# EAGLE schematic BBB_v1 (EAGLE 5.11)
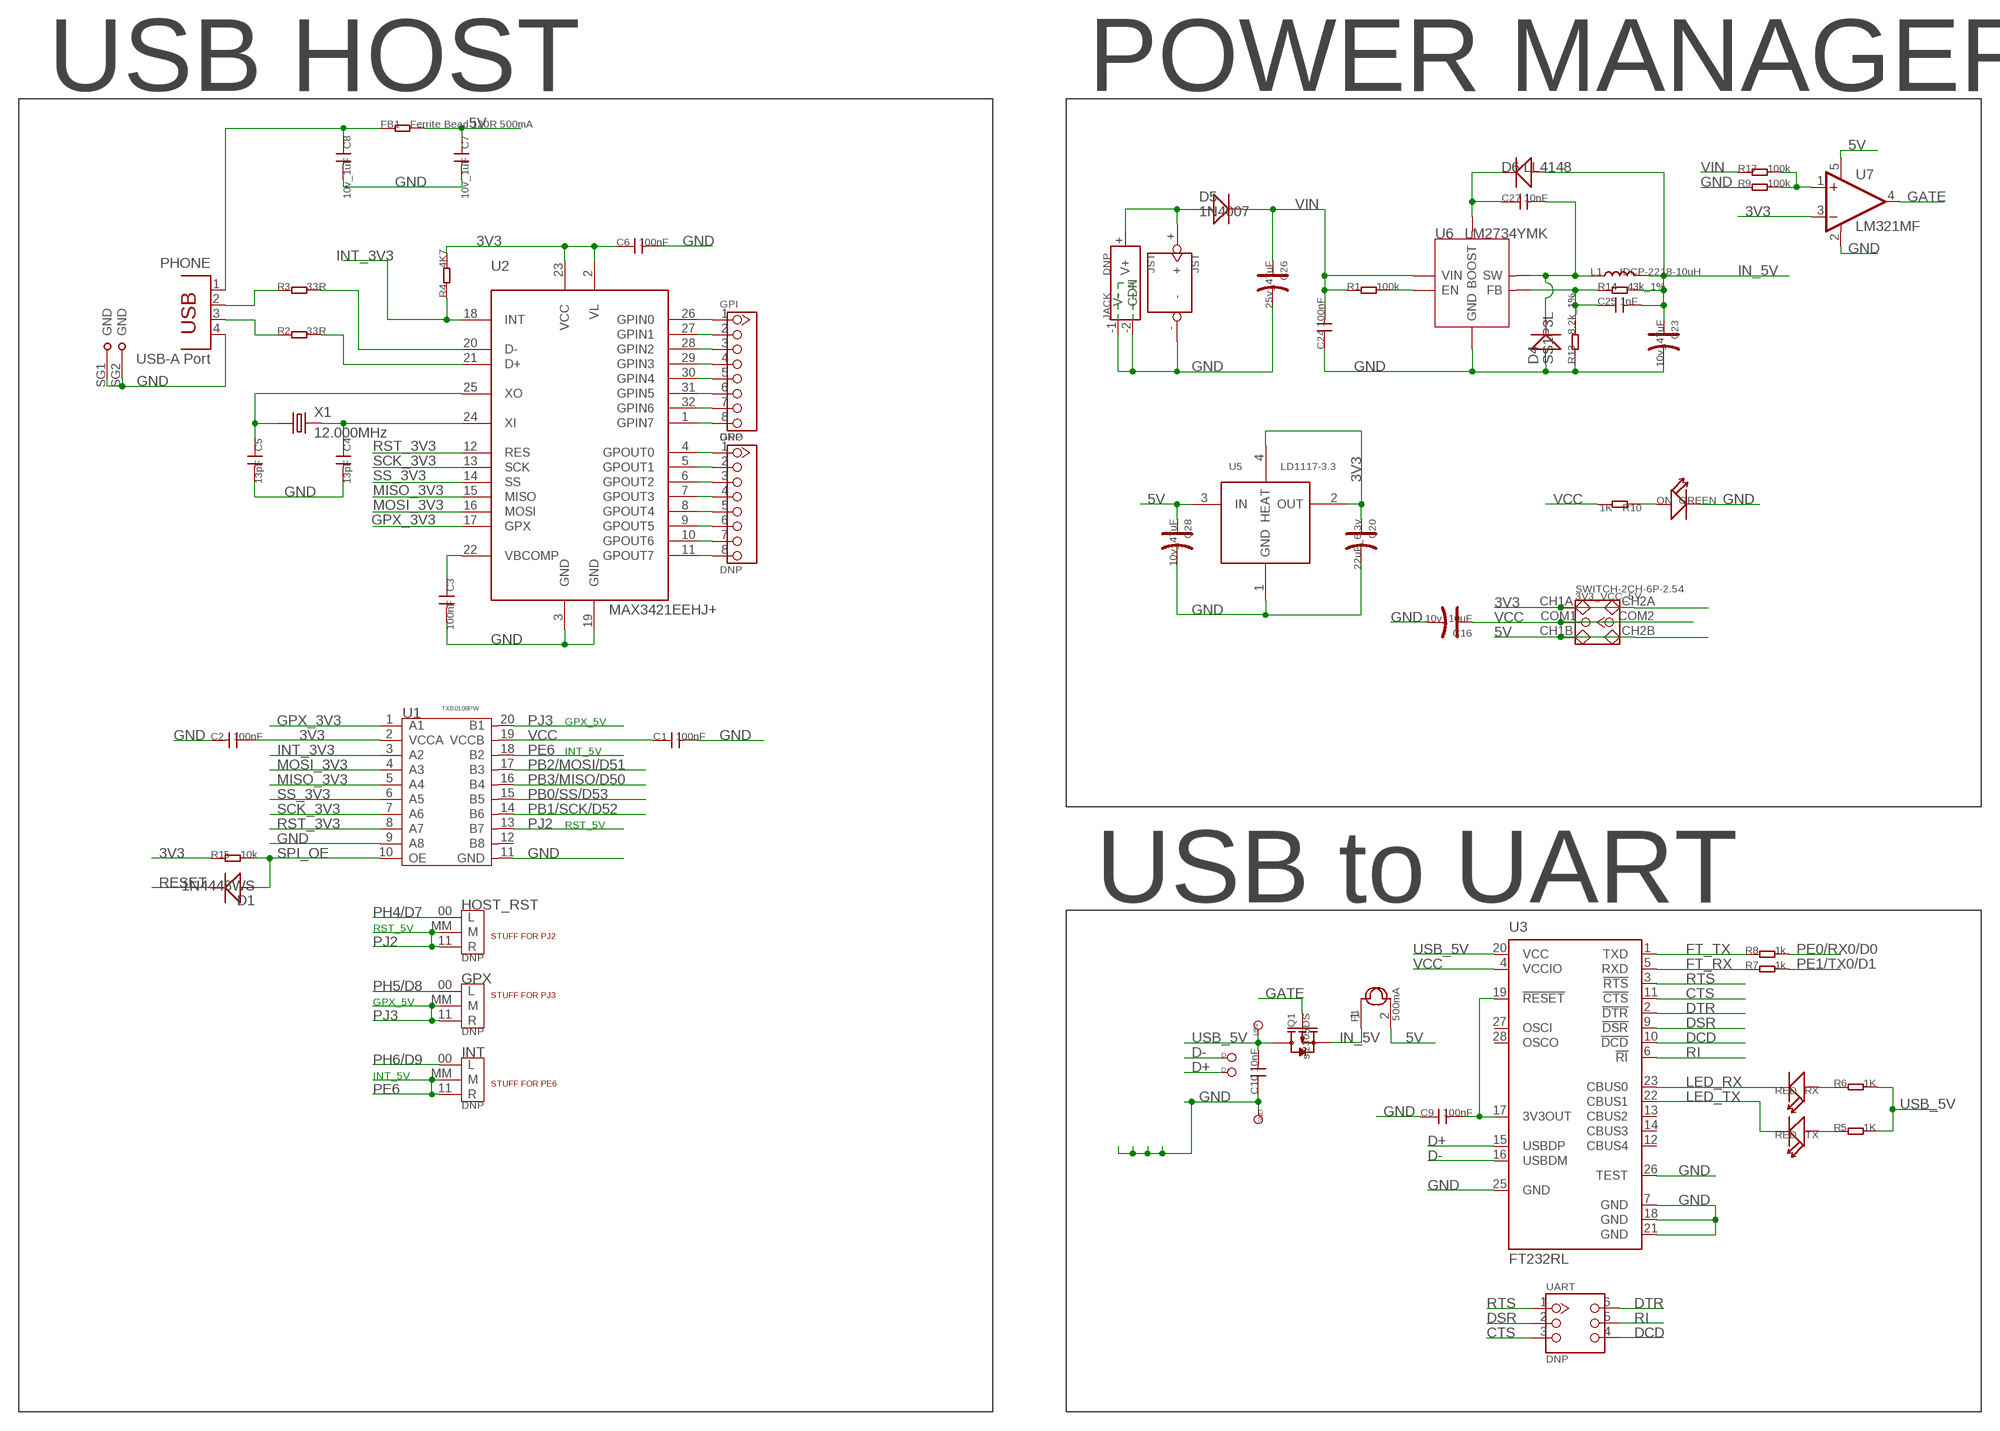
[diagram p0: schematic, sheet 1, part 1 of 2]
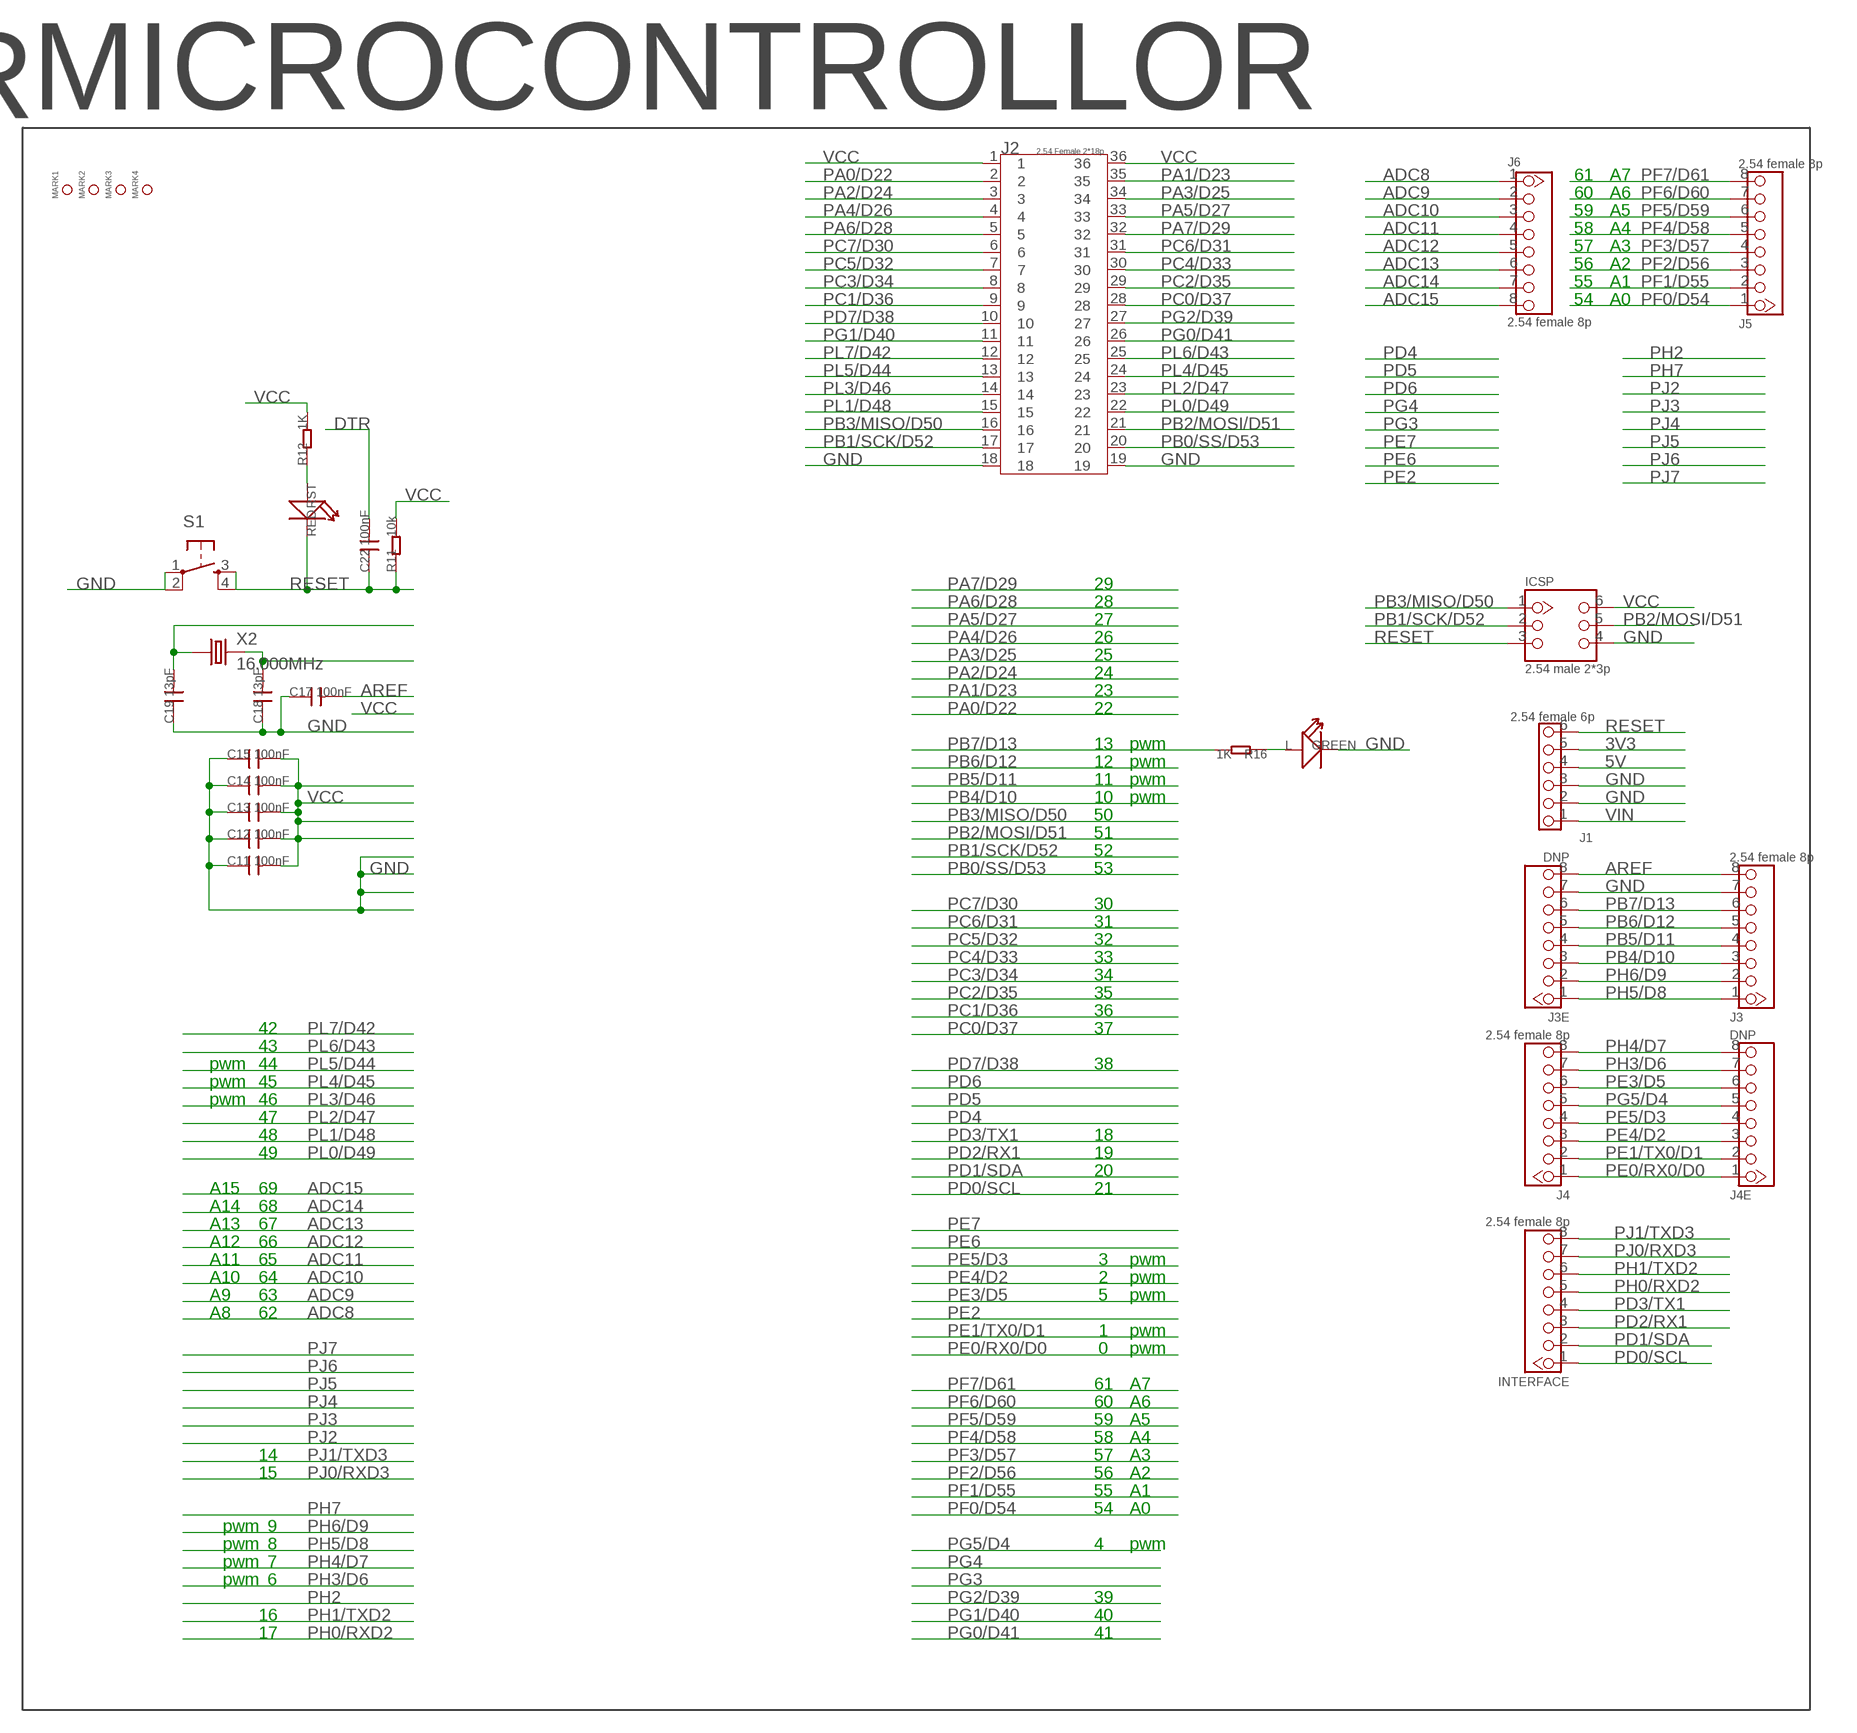
[diagram p1: schematic, sheet 1, part 2 of 2]

## Parts
3V3_VCC_5V  SWITCH-2CH-6P-2.54  [2.54SW-2CH]
C1  100nF  C-0402  [0402]
C2  100nF  C-0402  [0402]
C3  100nF  C-0402  [0402]
C4  13pF  C-0402  [0402]
C5  13pF  C-0402  [0402]
C6  100nF  C-0402  [0402]
C7  10v_1uF  C-0603  [0603]
C8  10v_1uF  C-0603  [0603]
C9  100nF  C-0402  [0402]
C10  10nF  C-0402  [0402]
C11  100nF  C-0402  [0402]
C12  100nF  C-0402  [0402]
C13  100nF  C-0402  [0402]
C14  100nF  C-0402  [0402]
C15  100nF  C-0402  [0402]
C16  10v_10uF  CAP_AVX_A  [AVX-A]
C17  100nF  C-0402  [0402]
C18  13pF  C-0402  [0402]
C19  13pF  C-0402  [0402]
C20  22uF_6.3v  CAP_AVX_A  [AVX-A]
C22  100nF  C-0402  [0402]
C23  10v_47uF  CAP_AVX_B  [AVX-B]
C24  100nF  C-0402  [0402]
C25  1nF  C-0402  [0402]
C26  25v_47uF  CAP_AVX_C  [AVX-C]
C27  10nF  C-0402  [0402]
C28  10v_47uF  CAP_AVX_B  [AVX-B]
D1  1N4448WS  D-0805  [D0805]
D4  SS1P3L  D-DO-220AA  [DO-220AA]
D5  1N4007  D-2010  [D2010]
D6  LL4148  D-1206  [D1206]
D+  DNP  TEST_POINT_SIZE_3030  [TP_3535]
D-  DNP  TEST_POINT_SIZE_3030  [TP_3535]
F1  500mA  FUSE-1206  [1206]
FB1  Ferrite Bead 120R 500mA  R-0603  [0603]
GND  DNP  TEST_POINT_SIZE_3030  [TP_3535]
GPI  DNP  HEADER-8P2.54  [CK_1X8]
GPO  DNP  HEADER-8P2.54  [CK_1X8]
GPX  DNP  PAD-JUMPER-3P40*40  [JUMPER]
HOST_RST  DNP  PAD-JUMPER-3P40*40  [JUMPER]
ICSP  2.54 male 2*3p  HEADER-2X3P2.54  [CK_2X3]
INT  DNP  PAD-JUMPER-3P40*40  [JUMPER]
INTERFACE  2.54 female 8p  HEADER-8P2.54  [CK_1X8]
J1  2.54 female 6p  HEADER-6PSTANDARD/2.54  [2.54_6P]
J2  2.54 Female 2*18p  HEADER-2X18P  [2.54-2X18P]
J3  2.54 female 8p  HEADER-8P2.54  [CK_1X8]
J3E  DNP  HEADER-8P2.54  [CK_1X8]
J4  2.54 female 8p  HEADER-8P2.54  [CK_1X8]
J4E  DNP  HEADER-8P2.54  [CK_1X8]
J5  2.54 female 8p  HEADER-8P2.54  [CK_1X8]
J6  2.54 female 8p  HEADER-8P2.54  [CK_1X8]
JACK  DNP  JACK-3.5MM_3.5MM  [3.5MM_JACK]
JST  JST  JACK-2P  [PWR_JST]
L  GREEN  LED-0603  [D0603]
L1  IDCP-2218-10uH  L  [2281]
MARK1  DNP  PAD-MARK-30  [MARK_30]
MARK2  DNP  PAD-MARK-30  [MARK_30]
MARK3  DNP  PAD-MARK-30  [MARK_30]
MARK4  DNP  PAD-MARK-30  [MARK_30]
ON  GREEN  LED-0603  [D0603]
PHONE  USB-A Port  PN87520  [PN87520]
Q1  si2305DS  MOSFET-P-SOT23  [SOT23_]
R1  100k  R-0402  [0402]
R2  33R  R-0402  [0402]
R3  33R  R-0402  [0402]
R4  4K7  R-0402  [0402]
R5  1K  R-0402  [0402]
R6  1K  R-0402  [0402]
R7  1k  R-0402  [0402]
R8  1k  R-0402  [0402]
R9  100k  R-0402  [0402]
R10  1K  R-0402  [0402]
R11  10k  R-0402  [0402]
R12  1K  R-0402  [0402]
R13  8.2k_1%  R-0402  [0402]
R14  43k_1%  R-0402  [0402]
R15  10k  R-0402  [0402]
R16  1K  R-0402  [0402]
R17  100k  R-0402  [0402]
RST  RED  LED-0603  [D0603]
RX  RED  LED-0603  [D0603]
S1  TAC_SWITCHSMD  [TACTILE_SWITCH_SMD]
TX  RED  LED-0603  [D0603]
U1  TXB0108PW  TXB0108  [TSSOP20]
U2  MAX3421EEHJ+  MAX3421EEHJ  [TQFP32-05]
U3  FT232RL  [SSOP28]
U5  LD1117-3.3  LD1117SOT89  [SOT89]
U5V  DNP  TEST_POINT_SIZE_3030  [TP_3535]
U6  LM2734YMK  LM2734  [TSOT6]
U7  LM321MF  LM321  [SOT23-5]
UART  DNP  HEADER-2X3P2.54  [CK_2X3]
X1  12.000MHz  CRYSTAL-5032  [5032]
X2  16.000MHz  CRYSTAL-5032  [5032]

## Nets
3V3: 3V3_VCC_5V.CH1A 3V3_VCC_5V.CH2A C2.1 C6.1 C20.+ J1.5 R4.2 R15.1 U1.2(VCCA) U2.2(VL) U2.23(VCC) U5.2(OUT) U5.4(HEAT) U7.3(-IN)
5V: 3V3_VCC_5V.CH1B 3V3_VCC_5V.CH2B C7.1 C28.+ F1.2 FB1.2 J1.4 U5.3(IN) U7.5(V+)
ADC8: J6.1
ADC9: J6.2
ADC10: J6.3
ADC11: J6.4
ADC12: J6.5
ADC13: J6.6
ADC14: J6.7
ADC15: J6.8
AREF: C17.2 J3.8 J3E.8
CTS: U3.11(!CTS) UART.3
D+: D+.T U3.15(USBDP)
D-: D-.T U3.16(USBDM)
DCD: U3.10(!DCD) UART.4
DSR: U3.9(!DSR) UART.2
DTR: C22.2 U3.2(!DTR) UART.6
FT_RX: R7.1 U3.5(RXD)
FT_TX: R8.1 U3.1(TXD)
GATE: Q1.1(G) U7.4(OUT)
GND: C1.2 C2.2 C3.2 C4.2 C5.2 C6.2 C7.2 C8.2 C9.1 C10.1 C11.1 C12.1 C13.1 C14.1 C15.1 C16.- C17.1 C18.1 C19.1 C20.- C23.- C24.1 C26.- C28.- D4.+ GND.T ICSP.4 J1.2 J1.3 J2.18 J2.19 J3.7 J3E.7 JACK.-1(V-) JACK.-2(CDN) JST.- L.- ON.- PHONE.4 PHONE.SG1(GND) PHONE.SG2(GND) R9.1 R13.1 S1.1 S1.2 U1.9(A8) U1.11(GND) U2.3(GND) U2.19(GND) U3.7(GND) U3.18(GND) U3.21(GND) U3.25(GND) U3.26(TEST) U5.1(GND) U6.2(GND) U7.2(V-)
GPX_3V3: U1.1(A1) U2.17(GPX)
IN_5V: C23.+ C25.2 D6.+ F1.1 L1.P$2 Q1.2(S) R14.2
INT_3V3: R4.1 U1.3(A2) U2.18(INT)
LED_RX: RX.- U3.23(CBUS0)
LED_TX: TX.- U3.22(CBUS1)
MISO_3V3: U1.5(A4) U2.15(MISO)
MOSI_3V3: U1.4(A3) U2.16(MOSI)
N$1: C9.2 U3.17(3V3OUT) U3.19(!RESET)
N$2: C18.2 X2.2
N$3: C19.2 X2.1
N$5: D5.+ JACK.+(V+) JST.+
N$6: R1.2 U6.4(EN)
N$7: C27.1 D6.- U6.1(BOOST)
N$8: C27.2 D4.- L1.P$1 U6.6(SW)
N$9: R9.2 R17.2 U7.1(+IN)
N$10: PHONE.2 R3.1
N$11: PHONE.3 R2.1
N$12: R3.2 U2.20(D-)
N$13: R2.2 U2.21(D+)
N$14: C8.1 FB1.1 PHONE.1
N$15: C4.1 U2.24(XI) X1.2
N$16: C5.1 U2.25(XO) X1.1
N$17: C25.1 R13.2 R14.1 U6.3(FB)
N$18: GPI.2 U2.27(GPIN1)
N$19: GPI.3 U2.28(GPIN2)
N$20: GPI.4 U2.29(GPIN3)
N$21: GPI.5 U2.30(GPIN4)
N$22: GPI.6 U2.31(GPIN5)
N$23: GPI.7 U2.32(GPIN6)
N$24: GPI.8 U2.1(GPIN7)
N$25: GPI.1 U2.26(GPIN0)
N$26: GPO.2 U2.5(GPOUT1)
N$27: GPO.3 U2.6(GPOUT2)
N$28: GPO.4 U2.7(GPOUT3)
N$29: GPO.5 U2.8(GPOUT4)
N$30: GPO.6 U2.9(GPOUT5)
N$31: GPO.7 U2.10(GPOUT6)
N$32: GPO.8 U2.11(GPOUT7)
N$33: GPO.1 U2.4(GPOUT0)
N$34: R5.1 TX.+
N$35: R6.1 RX.+
N$36: L.+ R16.1
N$37: ON.+ R10.1
N$38: R12.1 RST.+
N$39: C3.1 U2.22(VBCOMP)
PA0/D22: J2.2
PA1/D23: J2.35
PA2/D24: J2.3
PA3/D25: J2.34
PA4/D26: J2.4
PA5/D27: J2.33
PA6/D28: J2.5
PA7/D29: J2.32
PB0/SS/D53: J2.20 U1.15(B5)
PB1/SCK/D52: ICSP.2 J2.17 U1.14(B6)
PB2/MOSI/D51: ICSP.5 J2.21 U1.17(B3)
PB3/MISO/D50: ICSP.1 J2.16 U1.16(B4)
PB4/D10: J3.3 J3E.3
PB5/D11: J3.4 J3E.4
PB6/D12: J3.5 J3E.5
PB7/D13: J3.6 J3E.6 R16.2
PC0/D37: J2.28
PC1/D36: J2.9
PC2/D35: J2.29
PC3/D34: J2.8
PC4/D33: J2.30
PC5/D32: J2.7
PC6/D31: J2.31
PC7/D30: J2.6
PD0/SCL: INTERFACE.1
PD1/SDA: INTERFACE.2
PD2/RX1: INTERFACE.3
PD3/TX1: INTERFACE.4
PD7/D38: J2.10
PE0/RX0/D0: J4.1 J4E.1 R8.2
PE1/TX0/D1: J4.2 J4E.2 R7.2
PE3/D5: J4.6 J4E.6
PE4/D2: J4.3 J4E.3
PE5/D3: J4.4 J4E.4
PE6: INT.11(R) INT.MM(M) U1.18(B2)
PF0/D54: J5.1
PF1/D55: J5.2
PF2/D56: J5.3
PF3/D57: J5.4
PF4/D58: J5.5
PF5/D59: J5.6
PF6/D60: J5.7
PF7/D61: J5.8
PG0/D41: J2.26
PG1/D40: J2.11
PG2/D39: J2.27
PG5/D4: J4.5 J4E.5
PH0/RXD2: INTERFACE.5
PH1/TXD2: INTERFACE.6
PH3/D6: J4.7 J4E.7
PH4/D7: HOST_RST.00(L) J4.8 J4E.8
PH5/D8: GPX.00(L) J3.1 J3E.1
PH6/D9: INT.00(L) J3.2 J3E.2
PJ0/RXD3: INTERFACE.7
PJ1/TXD3: INTERFACE.8
PJ2: HOST_RST.11(R) HOST_RST.MM(M) U1.13(B7)
PJ3: GPX.11(R) GPX.MM(M) U1.20(B1)
PL0/D49: J2.22
PL1/D48: J2.15
PL2/D47: J2.23
PL3/D46: J2.14
PL4/D45: J2.24
PL5/D44: J2.13
PL6/D43: J2.25
PL7/D42: J2.12
RESET: C22.1 D1.- ICSP.3 J1.6 R11.1 RST.- S1.3 S1.4
RI: U3.6(!RI) UART.5
RST_3V3: U1.8(A7) U2.12(RES)
RTS: U3.3(!RTS) UART.1
SCK_3V3: U1.7(A6) U2.13(SCK)
SPI_OE: D1.+ R15.2 U1.10(OE)
SS_3V3: U1.6(A5) U2.14(SS)
USB_5V: C10.2 Q1.3(D) R5.2 R6.2 U3.20(VCC) U5V.T
VCC: 3V3_VCC_5V.COM1 3V3_VCC_5V.COM2 C1.1 C11.2 C12.2 C13.2 C14.2 C15.2 C16.+ ICSP.6 J2.1 J2.36 R10.2 R11.2 R12.2 U1.19(VCCB) U3.4(VCCIO)
VIN: C24.2 C26.+ D5.- J1.1 R1.1 R17.1 U6.5(VIN)
Unconnected: U1.12(B8) U3.12(CBUS4) U3.13(CBUS2) U3.14(CBUS3) U3.27(OSCI) U3.28(OSCO)

## Notes on the sheet
- USB HOST | POWER MANAGER | MICROCONTROLLOR
- 61 | A7
- 60 | A6
- 59 | A5
- 58 | A4
- 57 | A3
- 56 | A2
- 55 | A1
- 54 | A0
- 29
- 28
- 27
- 26
- 25
- 24
- 23
- 22
- 13 | pwm
- 12 | pwm
- 11 | pwm
- 10 | pwm
- 50
- 51
- 52
- 53
- GPX_5V
- 30
- INT_5V
- 31
- 32
- 33
- 34
- 35
- RST_5V
- 36
- 42 | 37
- 43
- pwm | 44 | 38
- pwm | 45
- USB to UART
- pwm | 46
- 47
- RST_5V
- STUFF FOR PJ2 | 48 | 18
- 49 | 19
- 20
- A15 | 69 | 21
- STUFF FOR PJ3 | A14 | 68
- GPX_5V
- A13 | 67
- A12 | 66
- A11 | 65 | 3 | pwm
- A10 | 64 | 2 | pwm
- A9 | 63 | 5 | pwm
- INT_5V
- STUFF FOR PE6 | A8 | 62
- 1 | pwm
- 0 | pwm
- 61 | A7
- 60 | A6
- 59 | A5
- 58 | A4
- 14 | 57 | A3
- 15 | 56 | A2
- 55 | A1
- 54 | A0
- pwm | 9
- pwm | 8 | 4 | pwm
- pwm | 7
- pwm | 6
- 39
- 16 | 40
- 17 | 41

## Library data of the parts
3V3_VCC_5V = Discrete:SWITCH-2CH-6P
C1-C15 C17-C19 C22 C24 C25 C27 = Discrete:C*: Ceramic Capacitors
C16 C20 C23 C26 C28 = Discrete:CAP*: Electrolytic Capacitors,Tantalum Capacitors and Super Capacitors
D1 D4-D6 = Discrete:D*
D+ D- GND U5V = For_Test_Albert:TEST_POINT
F1 = Discrete:FUSE
FB1 R1-R17 = Discrete:R*
GPI GPO INTERFACE J3 J3E J4 J4E J5 J6 = Connector:HEADER-8P
GPX HOST_RST INT = Discrete:PAD-JUMPER-3P
ICSP UART = Connector:HEADER-2X3P
J1 = Connector:HEADER-6P
J2 = Connector:HEADER-2X18P
JACK = Connector:JACK-3.5MM
JST = Connector:JACK-2P
L ON RST RX TX = Discrete:LED*
L1 = Discrete:L*
MARK1-MARK4 = Discrete:PAD-MARK
PHONE = con-berg:PN87520: BERG
Q1 = Discrete:MOSFET-P: Si2305DS Si2323CDS
S1 = SparkFun:TAC_SWITCH: Momentary Switch Button commonly used for reset or general input. Spark Fun Electronics SKU : COM-00097
U1 = IC:TXB0108
U2 = bibaja:MAX3421EE: MAX3421 SPI to USB Interface Chip
U3 = ICs_v54:FT232R: Source: http://www.ftdichip.com/Documents/DataSheets/DS_FT232R_v104.pdf
U5 = IC:LD1117
U6 = IC:LM2734: http://www.national.com/ds/LM/LM2734.pdf
U7 = IC:LM321: http://www.national.com/ds/LM/LM321.pdf
X1 X2 = Discrete:CRYSTAL*: CRYSTAL

## Net classes
0 default: width 0.152 mm, drill 0.305 mm, clearance 0.152 mm